# Altium schematic sheet Gyroscope.SchDoc
size A4
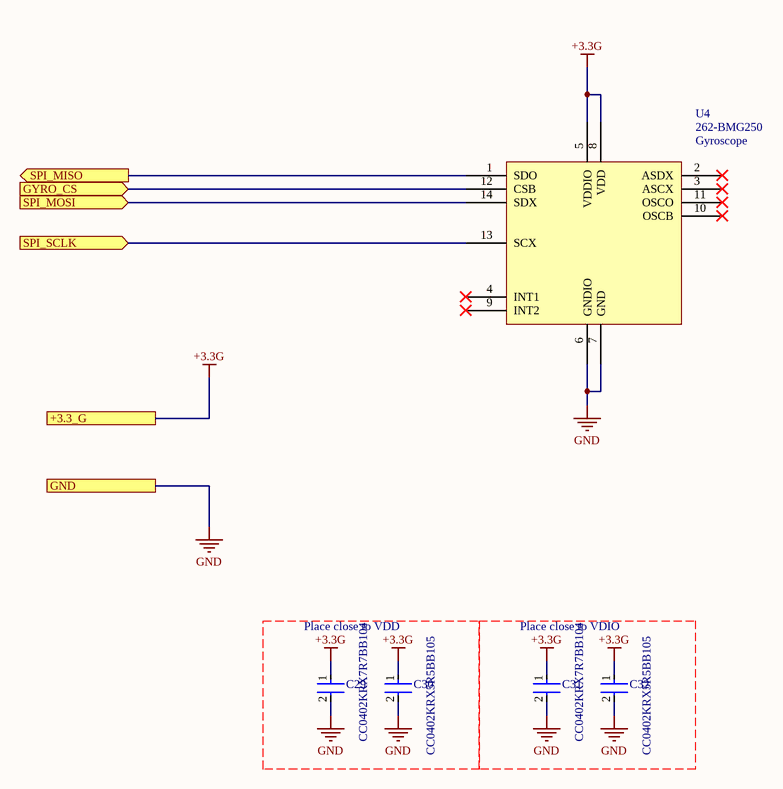
[diagram p0: Gyroscope.SchDoc]

## Parts
C29  CC0402KRX7R7BB104  [FP-CC0402-MFG]
C30  CC0402KRX5R5BB105  [FP-CC0402-MFG]
C31  CC0402KRX7R7BB104  [FP-CC0402-MFG]
C32  CC0402KRX5R5BB105  [FP-CC0402-MFG]
U4  Gyroscope  Supplier Part Number 1: 262-BMG250  [LGA14]

## Ports
+3.3_G, GND, GYRO_CS (in), SPI_MISO (out), SPI_MOSI (in), SPI_SCLK (in)

## Nets
+3.3G: C29.1 C30.1 C31.1 C32.1 U4.5(VDDIO) U4.8(VDD) ; port +3.3_G
GND: C29.2 C30.2 C31.2 C32.2 U4.6(GNDIO) U4.7(GND) ; port GND
GYRO_CS: U4.12(CSB) ; port GYRO_CS
SPI_MISO: U4.1(SDO) ; port SPI_MISO
SPI_MOSI: U4.14(SDX) ; port SPI_MOSI
SPI_SCLK: U4.13(SCX) ; port SPI_SCLK

Not connected (* = marked no-connect by the designer): U4 2(ASDX)* 3(ASCX)* 4(INT1)* 9(INT2)* 10(OSCB)* 11(OSCO)*

## Notes on the sheet
- Place close to VDD
- Place close to VDIO

## Library data of the parts
C29 C31 = CMP-03422-000048-1: CAP CER 0.1UF 16V X7R 0402; Manufacturer: YAGEO; Material: Ceramic; Automotive Grade: NA; Capacitance: 100 nF; Temperature Coefficient: 30ppm/°C; Tolerance: 0.1; Value: 100 nF; Device Class L1: Passive Components; Temperature Range Low: -55°C; Device Class L3: Ceramic Capacitors; Temperature Characteristic: X7R; Ipc Land Pattern Name: CAPC10050X50; Temperature Range High: +125°C; Voltage Rating: 16 V; Temperature: -55°C to +125°C; RoHS: TRUE; Automotive: No; Height: 0.55mm; Device Class L2: Capacitors; Digikey Description: CAP CER 0.1UF 16V X7R 0402; Package: CC0402; Footprint Url: http://www.yageo.com/exep/pages/download/literatures/UPY-C_GEN_24.pdf; ComponentLink2Description: Datasheet; Category: Cap; Lead Free: Yes; Octopart: https://octopart.com/cc0402krx7r7bb104-yageo-42244624; ComponentLink2URL: http://www.yageo.com/documents/recent/UPY-GP_NP0_16V-to-50V_16.pdf; Manufacturer Part Number: CC0402KRX7R7BB104; Mouser Description: 0402 0.1 uF 16 V ±10 % Tolerance X7R SMT Multilayer Ceramic Capacitor
C30 C32 = CMP-03422-000496-1: CAP CER 1UF 6.3V X5R 0402; Manufacturer: YAGEO; Automotive Grade: NA; Material: Ceramic; Tolerance: 0.1; Temperature Coefficient: 30ppm/°C; Voltage Rating: 6.3 V; Temperature Range Low: -55°C; Digikey Description: CAP CER 1UF 6.3V X5R 0402; Capacitance: 1 uF; Height: 0.55mm; Automotive: No; ComponentLink2URL: http://www.yageo.com/documents/recent/UPY-GP_NP0_16V-to-50V_16.pdf; Device Class L2: Capacitors; RoHS: TRUE; Temperature Range High: +125°C; Device Class L3: Ceramic Capacitors; Device Class L1: Passive Components; Temperature Characteristic: X5R; Package: CC0402; Octopart: https://octopart.com/cc0402krx5r5bb105-yageo-42244618; ComponentLink2Description: Datasheet; Temperature: -55°C to +125°C; Manufacturer Part Number: CC0402KRX5R5BB105; Mouser Description: Multilayer Ceramic Capacitors MLCC - SMD/SMT 1uF 6.3V X5R 10%; Category: Cap; Footprint Url: http://www.yageo.com/exep/pages/download/literatures/UPY-C_GEN_24.pdf; Lead Free: Yes; Ipc Land Pattern Name: CAPC10050X50; Value: 1 uF
U4 = BMG250: Supplier 1: Mouser